# EAGLE design Movimiento (EAGLE 7.5.0)
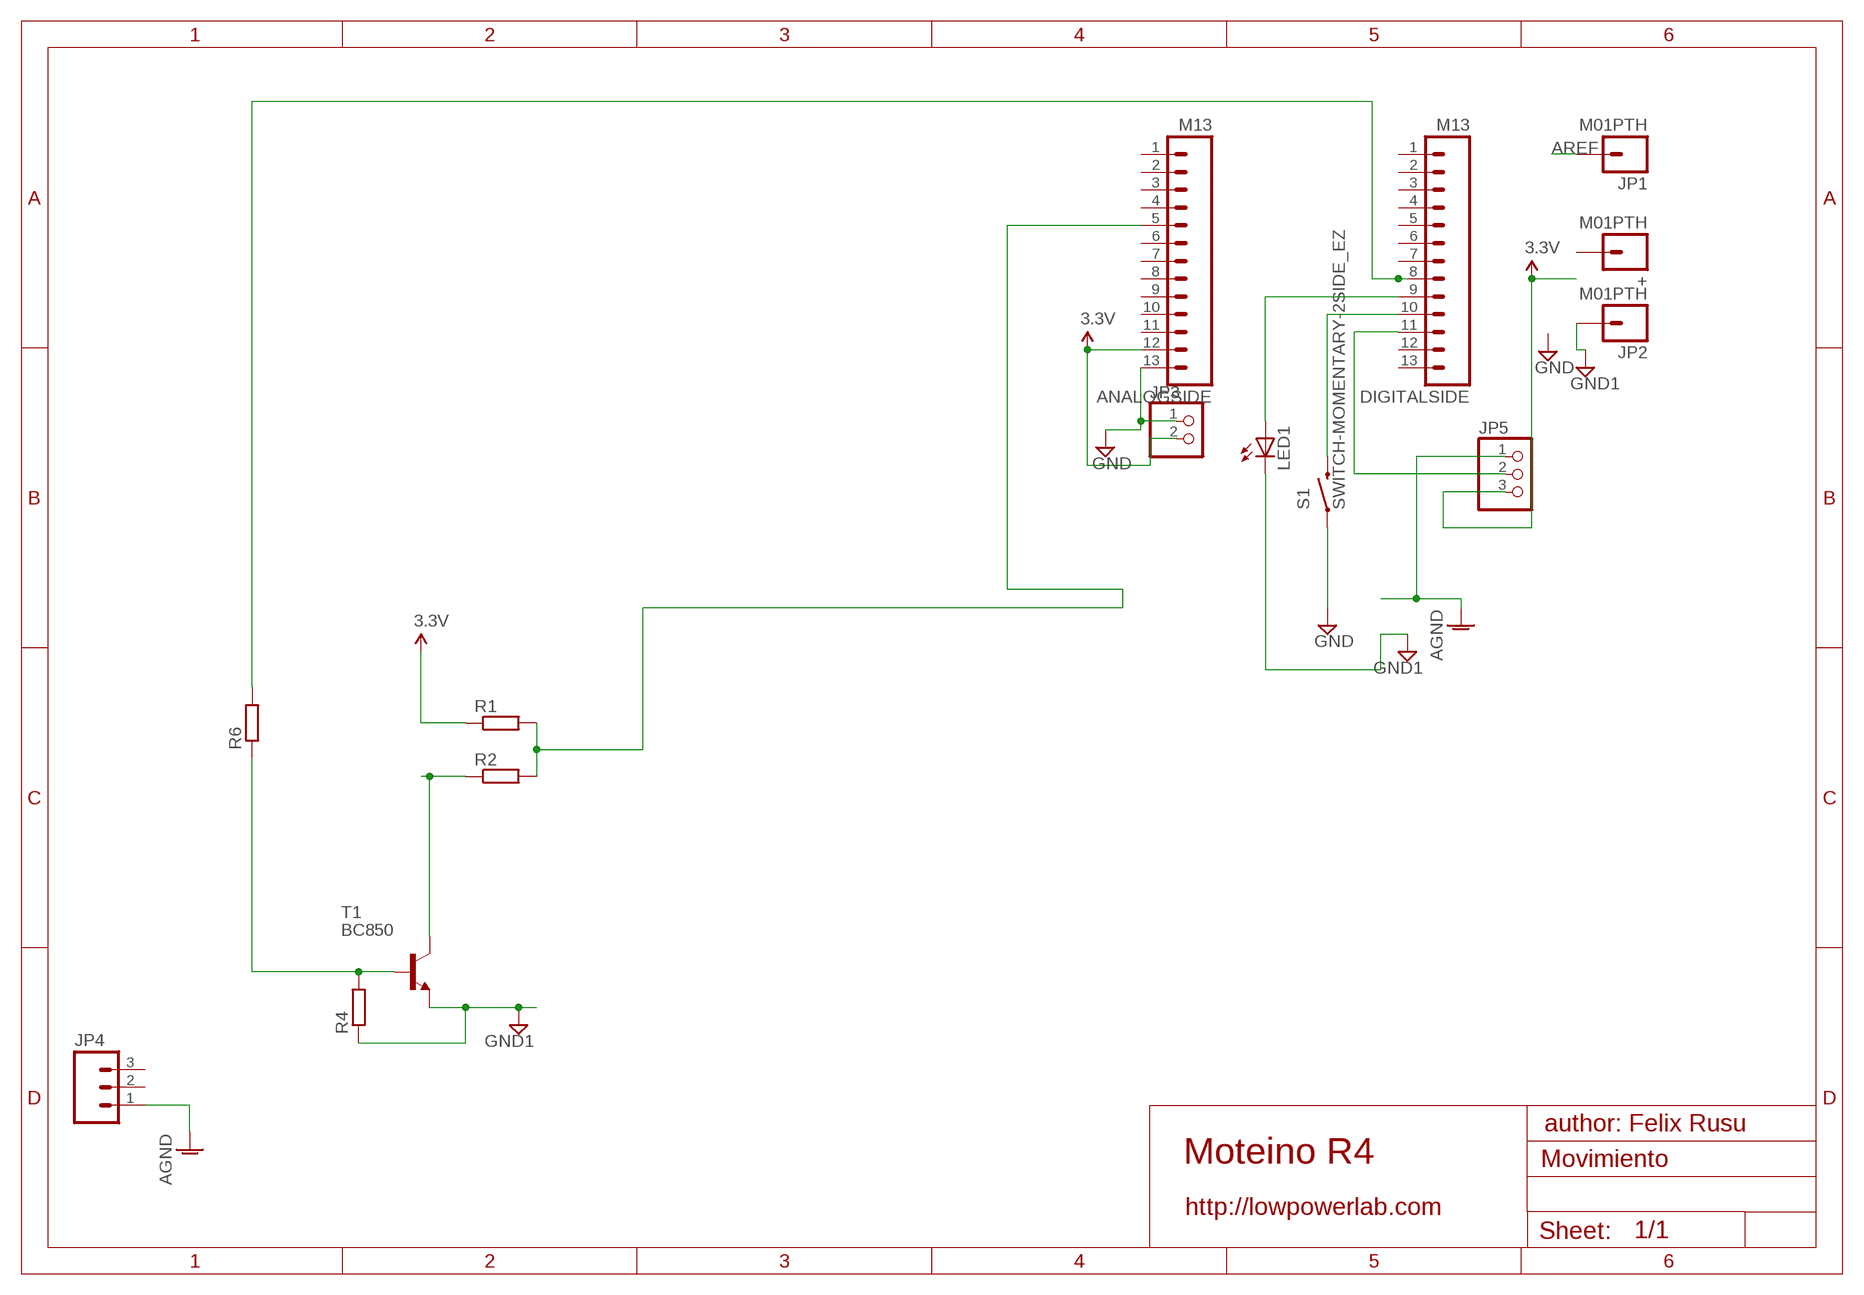
[diagram p0: schematic, sheet 1]

## Parts
+  M01PTH  [1X01]
ANALOGSIDE  M13  [1X13]
DIGITALSIDE  M13  [1X13]
JP1  M01PTH  [1X01]
JP2  M01PTH  [1X01]
JP3  PINHD-1X2  [1X02]
JP4  M03PTH  [1X03]
JP5  PINHD-1X3  [1X03]
LED1  LED3MM  [LED3MM]
R1  R-EU_0204/7  [0204/7]
R2  R-EU_0204/7  [0204/7]
R4  R-EU_M1206  [M1206]
R6  R-EU_M1206  [M1206]
S1  SWITCH-MOMENTARY-2SIDE_EZ  [TACTILE-PTH-SIDEEZ]
T1  BC850  [SOT23]

## Nets
AGND [power]: JP4.1 JP5.1
AREF: JP1.1
GND [power]: ANALOGSIDE.13 JP3.1 S1.1
GND1 [power]: JP2.1 LED1.K(C) R4.1 T1.2(E)
N$1: DIGITALSIDE.10 S1.2
N$2: DIGITALSIDE.11 JP5.2
N$3: DIGITALSIDE.8 R6.2
N$5: DIGITALSIDE.9 LED1.A
N$6: ANALOGSIDE.5 R1.2 R2.2
N$7: R2.1 T1.3(C)
N$8: R4.2 R6.1 T1.1(B)
VCC: ANALOGSIDE.12 JP3.2 JP5.3 R1.1 ; supply symbol labelled 3.3V
Unconnected: +.1 ANALOGSIDE.1 ANALOGSIDE.2 ANALOGSIDE.3 ANALOGSIDE.4 ANALOGSIDE.6 ANALOGSIDE.7 ANALOGSIDE.8 ANALOGSIDE.9 ANALOGSIDE.10 ANALOGSIDE.11 DIGITALSIDE.1 DIGITALSIDE.2 DIGITALSIDE.3 DIGITALSIDE.4 DIGITALSIDE.5 DIGITALSIDE.6 DIGITALSIDE.7 DIGITALSIDE.12 DIGITALSIDE.13 JP4.2 JP4.3

## Notes on the sheet
- author: Felix Rusu
- Moteino R4
- http://lowpowerlab.com

## Library data of the parts
+ JP1 JP2 = SparkFun-Connectors:M01: Header 1 Standard 1-pin 0.1" header. Use with straight break away headers (SKU : PRT-00116), right angle break away headers (PRT-00553), swiss pins (PRT-00743), machine pins (PRT-00117), and female headers (PRT-00115).
ANALOGSIDE DIGITALSIDE = SparkFun-Connectors:M13: 13-pin single row .1" header
JP3 = pinhead:PINHD-1X2: PIN HEADER
JP4 = SparkFun-Connectors:M03: Header 3 Standard 3-pin 0.1" header. Use with straight break away headers (SKU : PRT-00116), right angle break away headers (PRT-00553), swiss pins (PRT-00743), machine pins (PRT-00117), and female headers (PRT-00115). Molex polarized connector foot print use with SKU : PRT-08232 with associated crimp pins and housings.
JP5 = pinhead:PINHD-1X3: PIN HEADER
LED1 = led:LED: LED OSRAM: - CHIPLED LG R971, LG N971, LY N971, LG Q971, LY Q971, LO R971, LY R971 LH N974, LH R974 LS Q976, LO Q976, LY Q976 LO Q996 - Hyper CHIPLED LW Q18S LB Q993, LB Q99A, LB R99A - SideLED LS A670, LO A670, LY A670, LG A670, LP A670 LB A673, LV A673, LT A673, LW A673 LH A674 LY A675 LS A676, LA A676, LO A676, LY A676, LW A676 LS A679, LY A679, LG A679 - Hyper Micro SIDELED® LS Y876, LA Y876, LO Y876, LY Y876 LT Y87S - SmartLED LW L88C, LW L88S LB L89C, LB L89S, LG L890 LS L89K, LO L89K, LY L89K LS L896, LA L896, LO L896, LY L896 - TOPLED LS T670, LO T670, LY T670, LG T670, LP T670 LSG T670, LSP T670, LSY T670, LOP T670, LYG T670 LG T671, LOG T671, LSG T671 LB T673, LV T673, LT T673, LW T673 LH T674 LS T676, LA T676, LO T676, LY T676, LB T676, LH T676, LSB T676, LW T676 LB T67C, LV T67C, LT T67C, LS T67K, LO T67K, LY T67K, LW E67C LS E67B, LA E67B, LO E67B, LY E67B, LB E67C, LV E67C, LT E67C LW T67C LS T679, LY T679, LG T679 LS T770, LO T770, LY T770, LG T770, LP T770 LB T773, LV T773, LT T773, LW T773 LH T774 LS E675, LA E675, LY E675, LS T675 LS T776, LA T776, LO T776, LY T776, LB T776 LHGB T686 LT T68C, LB T68C - Hyper Mini TOPLED® LB M676 - Mini TOPLED Santana® LG M470 LS M47K, LO M47K, LY M47K Source: http://www.osram.convergy.de LUXEON: - LUMILED® LXK2-PW12-R00, LXK2-PW12-S00, LXK2-PW14-U00, LXK2-PW14-V00 LXK2-PM12-R00, LXK2-PM12-S00, LXK2-PM14-U00 LXK2-PE12-Q00, LXK2-PE12-R00, LXK2-PE12-S00, LXK2-PE14-T00, LXK2-PE14-U00 LXK2-PB12-K00, LXK2-PB12-L00, LXK2-PB12-M00, LXK2-PB14-N00, LXK2-PB14-P00, LXK2-PB14-Q00 LXK2-PR12-L00, LXK2-PR12-M00, LXK2-PR14-Q00, LXK2-PR14-R00 LXK2-PD12-Q00, LXK2-PD12-R00, LXK2-PD12-S00 LXK2-PH12-R00, LXK2-PH12-S00 LXK2-PL12-P00, LXK2-PL12-Q00, LXK2-PL12-R00 Source: www.luxeon.com KINGBRIGHT: KA-3528ASYC Source: www.kingbright.com
R1 R2 R4 R6 = rcl:R-EU_: RESISTOR, European symbol
S1 = SparkFun-Electromechanical:SWITCH-MOMENTARY-2: Various NO switches- pushbuttons, reed, etc
T1 = transistor:BC850: NPN TRANSISTOR

## Net classes
1 power: width 0.381 mm, clearance 0.254 mm

## Board
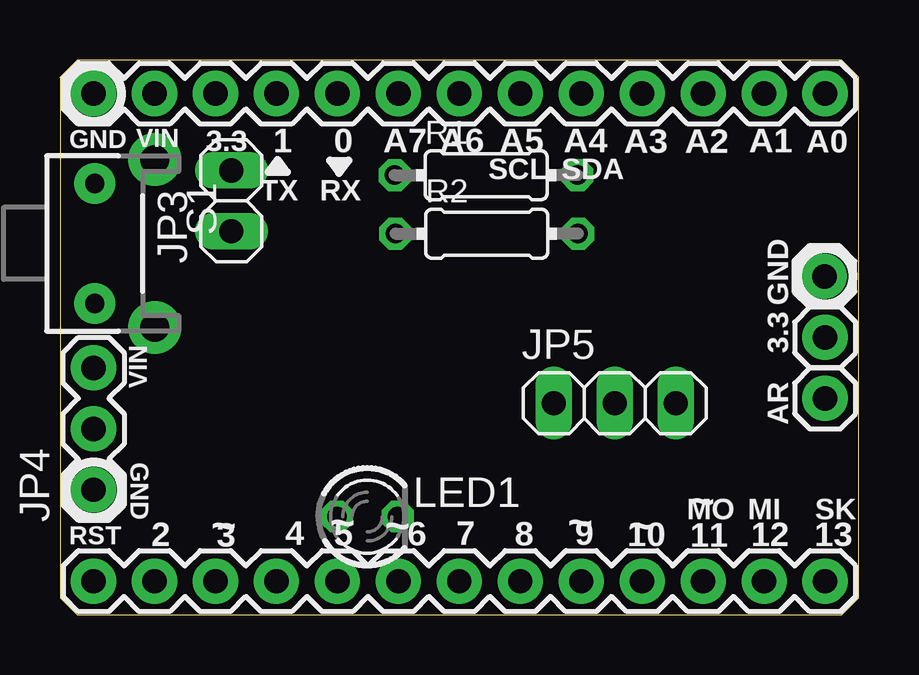
[diagram p1: board, top side]
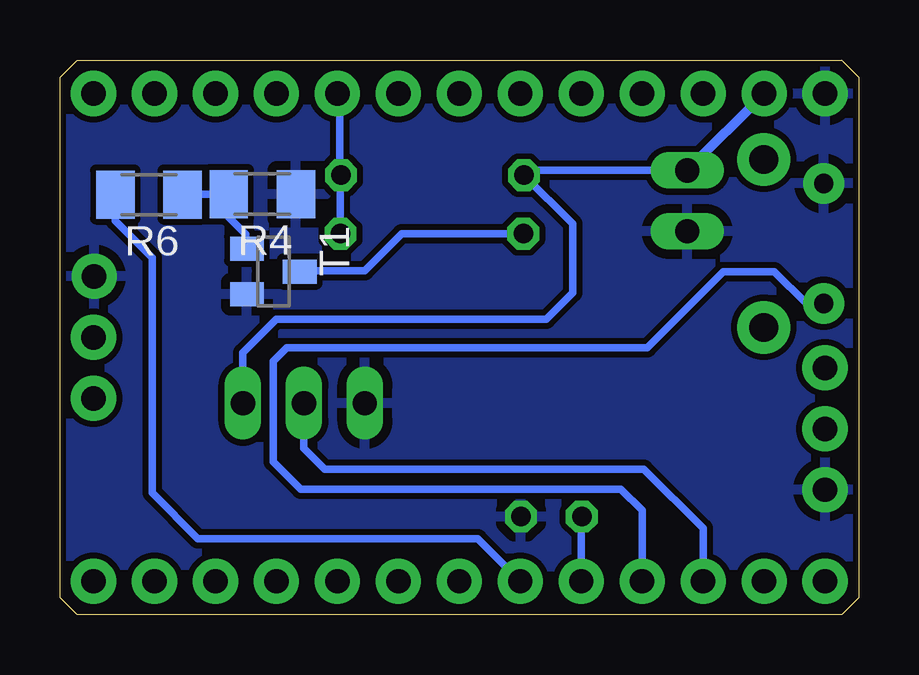
[diagram p2: board, bottom side, seen from below]

Size 33.27 x 23.11 mm. Coordinates in mm from the lower left corner, seen from the top.
Outline: 0.71,0 32.56,0 33.27,0.71 33.27,22.4 32.56,23.11 0.71,23.11 0,22.4 0,0.71 0.71,0
Copper layers (1*16): Top 0.035mm / dielectric 1.5mm / Bottom 0.035mm
Design rules "ITEADstudio_DRC *": minimum track width 6mil, minimum drill 12mil, track to track 6mil, track to pad 6mil, pad to pad 6mil, via to via 6mil, smd to smd 0mil, copper to edge 10mil, drill to drill 10mil, minimum pad ring 10mil, minimum via ring 6mil, stop-mask expansion 2mil, vias tented up to drill 100mil, thermal gap 15mil

### Footprints (pad centres in the part's own frame; a part is rotated, then mirrored left to right if it is on the bottom)
1X01 = drill 1.016 pad 1.88: 1 0,0
1X13 = drill 1.016 pad 1.88: 1 0,0; 2 2.54,0; 3 5.08,0; 4 7.62,0; 5 10.16,0; 6 12.7,0; 7 15.24,0; 8 17.78,0; 9 20.32,0; 10 22.86,0; 11 25.4,0; 12 27.94,0; 13 30.48,0
1X02 = drill 1.016 long: 1 -1.27,0; 2 1.27,0
1X03 = drill 1.016 pad 1.88: 1 0,0; 2 2.54,0; 3 5.08,0
1X03' = drill 1.016 long: 1 -2.54,0; 2 0,0; 3 2.54,0
LED3MM = drill 0.813 octagon: A -1.27,0; K 1.27,0
0204/7 = drill 0.813 octagon: 1 -3.81,0; 2 3.81,0
M1206 = smd 1.6 x 2: 1 -1.4,0; 2 1.4,0
TACTILE-PTH-SIDEEZ = drill 0.8 pad 1.7: 1 -2.5,0; 2 2.5,0 | drill 1.2 pad 2.2: ANCHOR1 -3.5,2.5; ANCHOR2 3.5,2.5
SOT23 = smd 1 x 1.4: 1 -0.95,-1.1; 2 0.95,-1.1; 3 0,1.1

### Placement (x,y rotation side)
+  31.88,11.56 270 top
ANALOGSIDE  31.88,21.72 180 top
DIGITALSIDE  31.88,1.4 180 top
JP1  31.88,9.02 0 top
JP2  31.85,14.1 0 top
JP3  7.14,17.25 90 top
JP4  1.4,5.21 90 top
JP5  [1X03']  23.11,8.81 0 top
LED1  12.8,4.09 0 top
R1  17.75,18.31 0 top
R2  17.78,15.88 0 top
R4  24.84,17.53 180 bottom
R6  29.57,17.5 180 bottom
S1  1.45,15.47 270 top
T1  24.38,14.3 270 bottom

### Tracks (layer width: path | path; a pad name or v marks a point on that pad's centre or on a via)
AGND
  pour Bottom: -0.23,23.75 33.78,23.75 33.78,-0.46 -0.3,-0.46 -0.3,23.72
GND
  pour Bottom: -0.13,23.19 33.45,23.19 33.45,-0.18 -0.13,-0.18
GND1
  pour Bottom: -1.68,24.21 34.42,24.21 34.42,-1.6 -1.68,-1.6
N$1
  Bottom 0.305: S1.2 2.17,12.97 3.5,14.3 5.64,14.3 8.81,11.12 23.82,11.12 24.38,10.57 24.38,6.38 23.24,5.23 9.91,5.23 9.02,4.34 DIGITALSIDE.10
N$2
  Bottom 0.305: DIGITALSIDE.11 6.48,3.61 8.94,6.07 22.25,6.07 23.11,6.93 JP5.2
N$3
  Bottom 0.305: R6.2 30.97,16.41 29.44,14.88 29.44,5.08 27.53,3.17 15.88,3.17 DIGITALSIDE.8
N$5
  Bottom 0.305: DIGITALSIDE.9 11.56,4.06 LED1.A
N$6
  Bottom 0.305: 21.61,21.61 21.61,18.36 R1.2 21.59,18.29 R2.2
  Bottom 0.406: 21.61,21.61 ANALOGSIDE.5
N$7
  Bottom 0.305: R2.1 19.02,15.88 20.57,14.33 23.26,14.33 T1.3
N$8
  Bottom 0.305: R6.1 28.14,17.53 R4.2 26.24,16.56 25.53,15.85 25.53,15.29 T1.1
VCC
  Bottom 0.305: JP5.3 25.65,10.92 24.26,12.32 13.01,12.32 11.91,13.41 11.91,16.28 R1.1 13.74,18.52 JP3.2
  Bottom 0.406: ANALOGSIDE.12 JP3.2

### Text on the board
_tsilk: VIN | 3.3 | 1 | 0 | A7 | A6 | A5 | A4 | A3 | A2 | A1 | GND | A0 | TX | RX | SCL | SDA | GND | 3.3 | VIN | AR | GND | 2 | 3 | 4 | 5 | 6 | 7 | 8 | 9 | 10 | MO | ~ | 11 | MI | 12 | SK | 13 | RST | ~ | ~ | ~ | ~ | ~